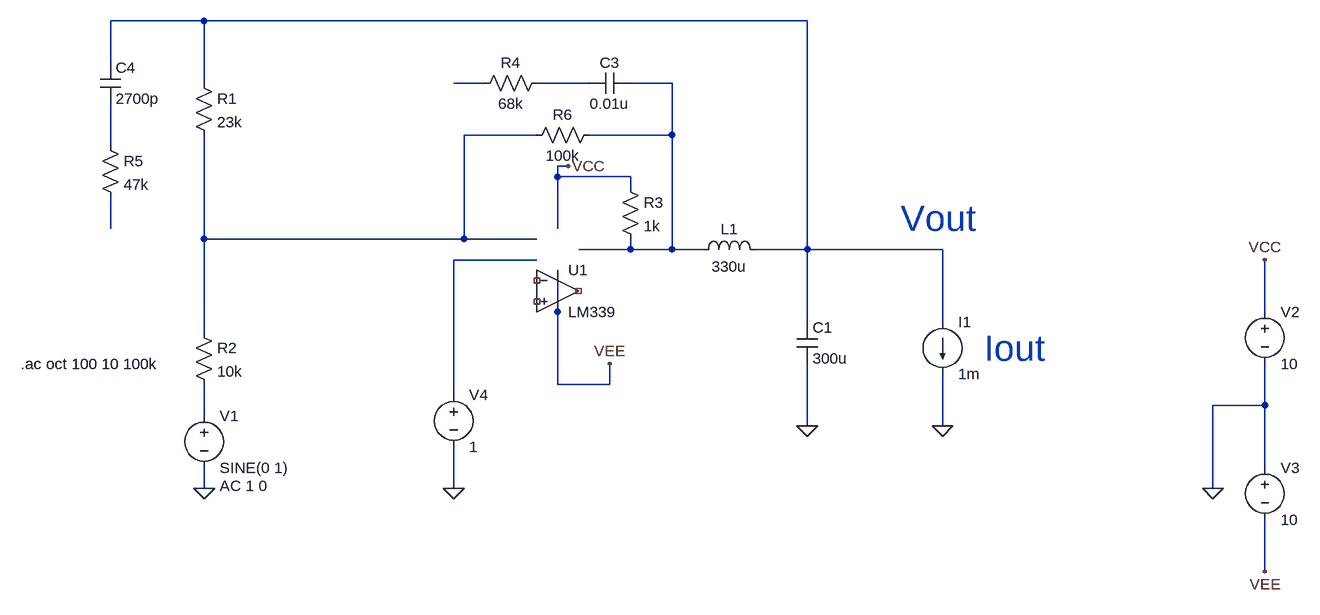
[diagram p0: schematic DC-DC phase comp.asc]
DC-DC phase comp.asc, the LTspice schematic file:
Version 4
SHEET 1 1548 680
WIRE -144 -304 -288 -304
WIRE 784 -304 -144 -304
WIRE -288 -240 -288 -304
WIRE -144 -208 -144 -304
WIRE 288 -208 240 -208
WIRE 448 -208 368 -208
WIRE 576 -208 512 -208
WIRE 368 -128 256 -128
WIRE 576 -128 576 -208
WIRE 576 -128 448 -128
WIRE -288 -112 -288 -176
WIRE 416 -80 400 -80
WIRE 400 -64 400 -80
WIRE 512 -64 400 -64
WIRE 512 -48 512 -64
WIRE -288 16 -288 -32
WIRE 400 16 400 -64
WIRE -144 32 -144 -128
WIRE 256 32 256 -128
WIRE 256 32 -144 32
WIRE 368 32 256 32
WIRE 512 48 512 32
WIRE 512 48 432 48
WIRE 576 48 576 -128
WIRE 576 48 512 48
WIRE 624 48 576 48
WIRE 784 48 784 -304
WIRE 784 48 704 48
WIRE 992 48 784 48
WIRE 368 64 240 64
WIRE 1488 144 1488 64
WIRE 784 160 784 48
WIRE 992 160 992 48
WIRE -144 176 -144 32
WIRE 400 256 400 80
WIRE 480 256 480 224
WIRE 480 256 400 256
WIRE 240 272 240 64
WIRE 1488 288 1488 224
WIRE 1488 288 1408 288
WIRE -144 304 -144 256
WIRE 784 320 784 224
WIRE 992 320 992 240
WIRE 1488 384 1488 288
WIRE -144 416 -144 384
WIRE 240 416 240 352
WIRE 1408 416 1408 288
WIRE 1488 544 1488 464
FLAG 784 320 0
FLAG 992 320 0
FLAG 1408 416 0
FLAG 1488 64 VCC
FLAG 1488 544 VEE
FLAG 480 224 VEE
FLAG 416 -80 VCC
FLAG 240 416 0
FLAG -144 416 0
SYMBOL ind 608 64 R270
WINDOW 0 32 56 VTop 2
WINDOW 3 5 56 VBottom 2
SYMATTR InstName L1
SYMATTR Value 330u
SYMBOL cap 768 160 R0
SYMATTR InstName C1
SYMATTR Value 300u
SYMATTR SpiceLine Rser=100m
SYMBOL current 992 160 R0
WINDOW 123 0 0 Left 2
WINDOW 39 0 0 Left 2
SYMATTR InstName I1
SYMATTR Value 1m
SYMBOL voltage -144 288 R0
WINDOW 123 24 124 Left 2
WINDOW 39 0 0 Left 2
SYMATTR InstName V1
SYMATTR Value SINE(0 1)
SYMATTR Value2 AC 1 0
SYMBOL Comparators\\LM339 400 48 R0
SYMATTR InstName U1
SYMBOL voltage 1488 128 R0
WINDOW 123 0 0 Left 2
WINDOW 39 0 0 Left 2
SYMATTR InstName V2
SYMATTR Value 10
SYMBOL voltage 1488 368 R0
WINDOW 123 0 0 Left 2
WINDOW 39 0 0 Left 2
SYMATTR InstName V3
SYMATTR Value 10
SYMBOL res -160 -224 R0
SYMATTR InstName R1
SYMATTR Value 23k
SYMBOL res -160 160 R0
SYMATTR InstName R2
SYMATTR Value 10k
SYMBOL voltage 240 256 R0
WINDOW 123 0 0 Left 2
WINDOW 39 0 0 Left 2
SYMATTR InstName V4
SYMATTR Value 1
SYMBOL res 496 -64 R0
SYMATTR InstName R3
SYMATTR Value 1k
SYMBOL res 384 -224 R90
WINDOW 0 0 56 VBottom 2
WINDOW 3 32 56 VTop 2
SYMATTR InstName R4
SYMATTR Value 68k
SYMBOL cap 512 -224 R90
WINDOW 0 0 32 VBottom 2
WINDOW 3 32 32 VTop 2
SYMATTR InstName C3
SYMATTR Value 0.01u
SYMBOL res -304 -128 R0
SYMATTR InstName R5
SYMATTR Value 47k
SYMBOL cap -304 -240 R0
SYMATTR InstName C4
SYMATTR Value 2700p
SYMBOL res 464 -144 R90
WINDOW 0 0 56 VBottom 2
WINDOW 3 32 56 VTop 2
SYMATTR InstName R6
SYMATTR Value 100k
TEXT 1056 200 Left 5 ;Iout
TEXT 928 0 Left 5 ;Vout
TEXT -426 224 Left 2 !.ac oct 100 10 100k

The netlist it stands for:
* DC-DC phase comp.asc
L1 N004 N001 330u
C1 N001 0 300u Rser=100m
I1 N001 0 1m
V1 N009 0 SINE(0 1) AC 1 0
XU1 NC_01 NC_02 VEE VEE NC_03 LM339  ; pins In+ In- V+ V- OUT
V2 VCC 0 10
V3 0 VEE 10
R1 N001 N005 23k
R2 N005 N009 10k
V4 N008 0 1
R3 VCC N004 1k
R4 N003 N002 68k
C3 N004 N003 0.01u
R5 N006 N007 47k
C4 N001 N006 2700p
R6 N004 N005 100k
* Iout
* Vout
.ac oct 100 10 100k
.lib LM339.sub
.backanno
.end